# Altium schematic sheet Power_Circuit.SchDoc
size A4; SheetNumber: 3; SheetTotal: 6
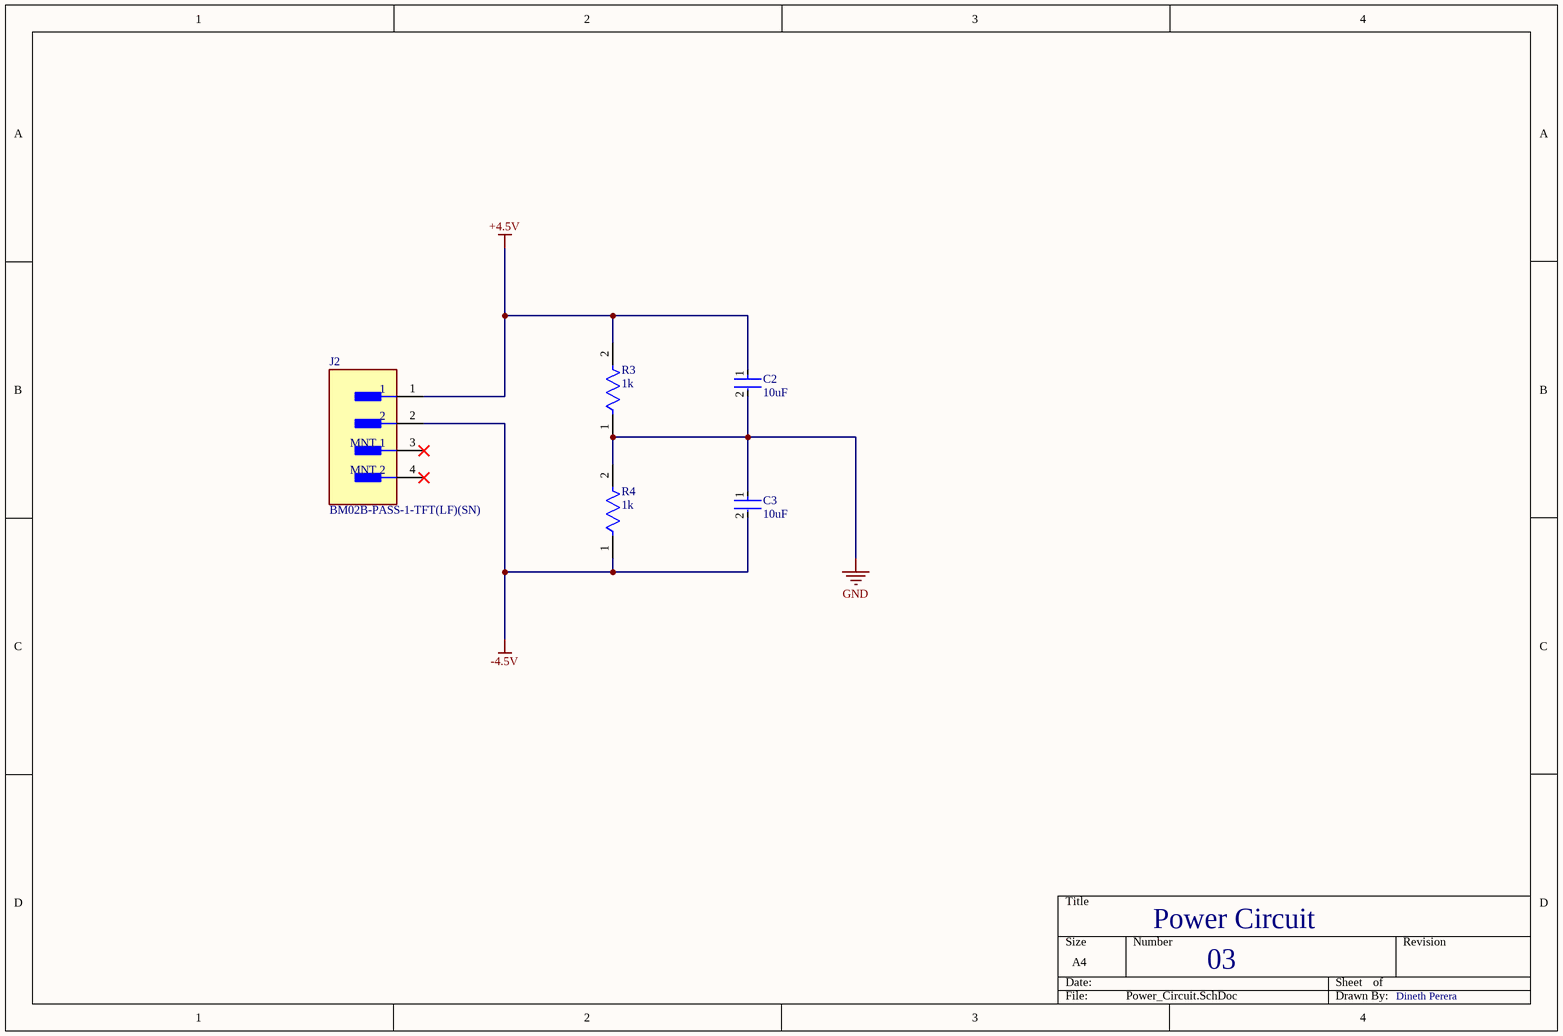
[diagram p0: Power_Circuit.SchDoc]

## Parts
C2  10uF  [FP-GRM21B-0_1-IPC_C]
C3  10uF  [FP-GRM21B-0_1-IPC_C]
J2  BM02B-PASS-1-TFT(LF)(SN)  [FP-BM02B-PASS-1-TFT_LF_S-MFG]
R3  1k  [FP-ERA6A-IPC_C]
R4  1k  [FP-ERA6A-IPC_C]

## Nets
+4.5V: C2.1 J2.1 R3.2
-4.5V: C3.2 J2.2 R4.1
GND: C2.2 C3.1 R3.1 R4.2

Not connected (* = marked no-connect by the designer): J2 3(MNT_1)* 4(MNT_2)*

## Notes on the sheet
- Power Circuit
- 03
- Dineth Perera

## Library data of the parts
C2 C3 = CMP-2007-03453-2: Chip Multilayer Ceramic Capacitors for General Purpose, 0805, 10uF, X5R, 15%, 10%, 16V; Radiation Hardening: No; Thickness: 0.053inch; Voltage Rating (DC): 16V; Lead Free: Lead Free; Package Quantity: 1; Width: 1.25mm; Case Code (Imperial): 0805; Depth: 1.25mm; Packaging: Tape and Reel; Dielectric: X5R; Max Operating Temperature: 85°C; Tolerance: 10%; Voltage Rating: 16V; Voltage: 16V; Capacitance: 10uF; Height: 1.25mm; Case Code (Metric): 2012; Material: Ceramic; Mount: Surface Mount; Case/Package: 0805; REACH SVHC: No SVHC; Length: 2mm; Min Operating Temperature: -55°C; Termination: SMD/SMT
J2 = CMP-17439-000073-1: CONN HEADER SMD 2POS 2MM; Number of Positions: 2; Gender: Male; Pitch: 0.079inch; Connector Type: Male Pin; Contact Plating: Tin; Contact Material: Copper; Color: Natural; Packaging: Tape and Reel; Series: PA; Termination: Solder; Mount: Surface Mount; Fastening Type: Ramp; Number of Rows: 1; Lead Free: Lead Free; Number of Contacts: 2; Contact Type: Male Pin
R3 R4 = CMP-2001-00581-2: RES 1K OHM 0.1% 1/8W 0805; Temperature Coefficient: 25ppm/°C; Resistance: 1kR; Working Voltage: 100V; Max Power Dissipation: 125mW; Height: 0.5mm; Technology: THIN FILM; REACH SVHC: No SVHC; Packaging: Tape and Reel; Length: 2mm; Width: 1.25mm; Resistance Tolerance: 0.1%; Series: ERA-6A; Resistor Type: Thin Film; Number of Pins: 2; Case Code (Metric): 2012; Voltage Rating: 100V; Radiation Hardening: No; Construction: Rectangular; Mount: Surface Mount; Number of Terminations: 2; Case/Package: 0805; Min Operating Temperature: -55°C; Military Standard: Not; RoHS Compliant: Yes; Termination: SMD/SMT; Case Code (Imperial): 0805; Depth: 1.25mm; Power Rating: 125mW; Max Operating Temperature: 155°C; Contact Plating: Tin; Package Quantity: 5000; Tolerance: 0.1%